# Altium schematic sheet +20_to_5.schdoc
size A; SheetNumber: 2; SheetTotal: 5
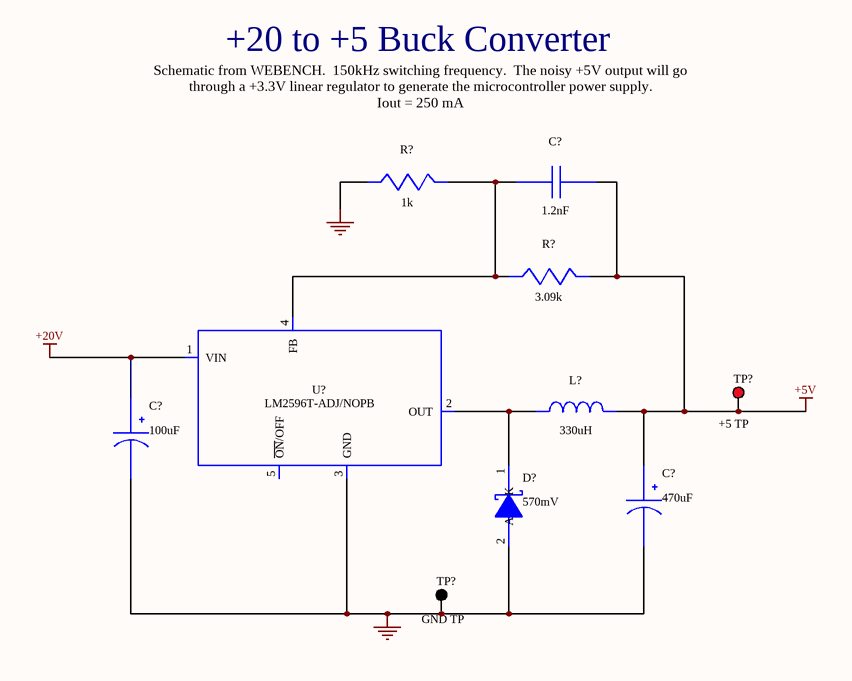
[diagram p0: +20_to_5.schdoc]

## Parts
(Parts that share a designator on the sheet are numbered #1, #2 ... from top to bottom, then left to right.)
C?#1  value 1.2nF  (hidden comment: CL21C122JBFNNNE)
C?#2  value 100uF  (hidden comment: EMVY500ADA101MHA0G)
C?#3  value 470uF  (hidden comment: EMVE630GTR471MLN0S)
D?  value 570mV  (hidden comment: PMEG6010CEH,115)
L?  value 330uH  (hidden comment: NPI34W331MTRF)
R?#1  value 1k  (hidden comment: ERJ-6ENF1001V)
R?#2  value 3.09k  (hidden comment: ERJ-6ENF3091V)
TP?#1  +5 TP  [KSTN-5010_V]
TP?#2  GND TP  [KSTN-5011_V]
U?  LM2596T-ADJ/NOPB

## Nets
0: C?#2.2(-) C?#3.2(-) D?.2(A) R?#1.2 TP?#2.1 U?.3(GND)
+5V: C?#1.1 C?#3.1(+) L?.2 R?#2.1 TP?#1.1
+20V: C?#2.1(+) U?.1(VIN)
NetC?#1_2: C?#1.2 R?#1.1 R?#2.2 U?.4(FB)
NetD?_1: D?.1(K) L?.1 U?.2(OUT)

Not connected (* = marked no-connect by the designer): U? 5(~{ON}/OFF)

## Notes on the sheet
- +20 to +5 Buck Converter
- Schematic from WEBENCH.  150kHz switching frequency.  The noisy +5V output will go through a +3.3V linear regulator to generate the microcontroller power supply.
  Iout = 250 mA

## Library data of the parts
C?#1 = CL21C122JBFNNNE: Manufacturer Name: Samsung Electro-Mechanics; PackageReference: CL21C122JBFNNNE; Manufacturer Part Number: CL21C122JBFNNNE
C?#2 = EMVY500ADA101MHA0G: EMVY500ADA101MHA; Manufacturer Name: Chemi-Con; PackageReference: EMVY500ADA101MHA0G; Manufacturer Part Number: EMVY500ADA101MHA0G
C?#3 = EMVE630GTR471MLN0S: EMVE630GTR471MLN; Manufacturer Name: Chemi-Con; PackageReference: EMVE630GTR471MLN0S; Manufacturer Part Number: EMVE630GTR471MLN0S
D? = PMEG6010CEH,115: Manufacturer Name: Nexperia; PackageReference: PMEG6010CEH,115; Manufacturer Part Number: PMEG6010CEH,115
L? = NPI34W331MTRF: Manufacturer Name: NIC Components; PackageReference: NPI34W331MTRF; Manufacturer Part Number: NPI34W331MTRF
R?#1 = ERJ-6ENF1001V: Manufacturer Name: Panasonic; PackageReference: ERJ-6ENF1001V; Manufacturer Part Number: ERJ-6ENF1001V
R?#2 = ERJ-6ENF3091V: Manufacturer Name: Panasonic; PackageReference: ERJ-6ENF3091V; Manufacturer Part Number: ERJ-6ENF3091V
TP?#1 = CMP-1672-00002-4: Test Point, Red, Through Hole, RoHS, Bulk; Manufacturer: Keystone; Contact Material: Bronze; Mounting Technology: Through Hole; RoHSCompliant: true; Pins: 1; Package Quantity: 100; ComponentLink2Description: Datasheet; Height: 8.12 mm; ComponentLink1URL: http://www.keyelco.com/; DatasheetVersion: Rev. F, 12/2013; Mount: Through Hole; PackageReference: 5010; Contact Plating: Silver; Packaging: Bulk; Colour: Red; REACH SVHC: No SVHC; PackageDescription: 1-Pin Through Hole Device, Dia 3.17 mm; ComponentLink2URL: http://www.keyelco.com/product-pdf.cfm?p=1319; ComponentLink1Description: Manufacturer URL
TP?#2 = CMP-1672-00003-4: Test Point, Black, Through Hole, RoHS, Bulk; Manufacturer: Keystone; ComponentLink2URL: http://www.keyelco.com/product-pdf.cfm?p=1320; Colour: Black; Pins: 1; REACH SVHC: No SVHC; ComponentLink1URL: http://www.keyelco.com/; PackageReference: 5011; Contact Plating: Silver; Package Quantity: 100; Packaging: Bulk; RoHSCompliant: true; Height: 8.12 mm; PackageDescription: 1-Pin Through Hole Device, Dia 3.17 mm; Mount: Through Hole; Mounting Technology: Through Hole; DatasheetVersion: Rev. F, 12/2013; ComponentLink1Description: Manufacturer URL; Contact Material: Bronze; ComponentLink2Description: Datasheet
U? = LM2596T-ADJ/NOPB: Manufacturer Name: Texas Instruments; PackageReference: LM2596T-ADJ/NOPB; Manufacturer Part Number: LM2596T-ADJ/NOPB; Value: N/A